# EAGLE design amg8833 (EAGLE 8.0.1)
PROJECT_AUTHOR: tinkerman.cat <xose.perez@gmail.com>; PROJECT_LICENSE: CC-BY-SA 3.0; PROJECT_NAME: AMG88XX BOARD; PROJECT_VERSION: 0.2.200170529
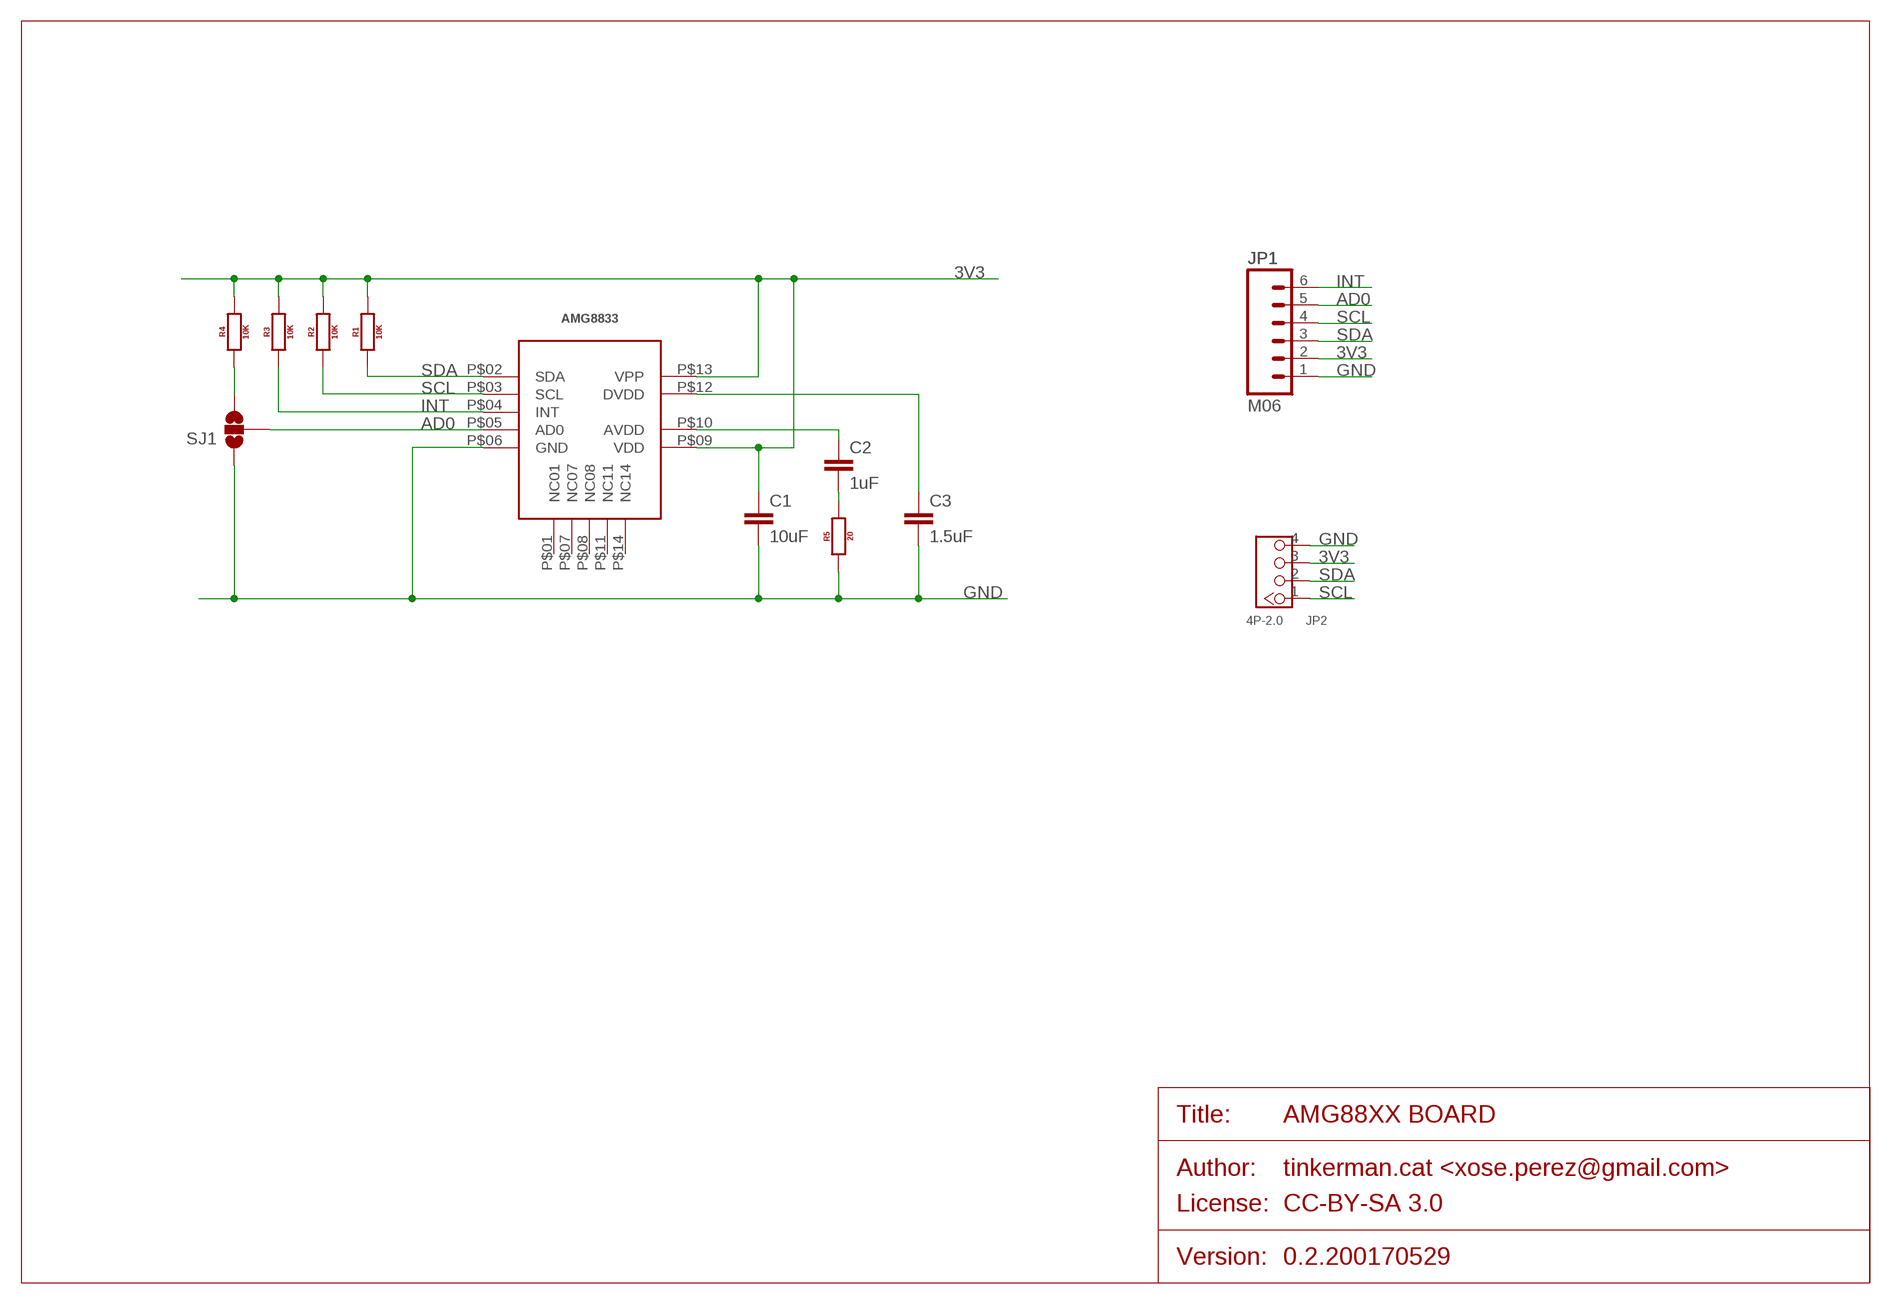
[diagram p0: schematic, sheet 1]

## Parts
AMG8833  AMG88XX  [AMG88XX]
C1  10uF  C-EU0805  [0805]
C2  1uF  C-EU0805  [0805]
C3  1.5uF  C-EU0805  [0805]
JP1  M06  [1X06_NO_SILK]
JP2  4P-2.0  GROVE-CONNECTOR-DIP(4P-2.0)  [HW4-2.0]
R1  10K  RESISTOR0805  [0805]
R2  10K  RESISTOR0805  [0805]
R3  10K  RESISTOR0805  [0805]
R4  10K  RESISTOR0805  [0805]
R5  20  RESISTOR0805  [0805]
SJ1  SOLDERJUMPER_2WAYS  [SJ_3]

## Nets
3V3: AMG8833.P$09(VDD) AMG8833.P$13(VPP) C1.1 JP1.2 JP2.3 R1.2 R2.2 R3.2 R4.2
AD0: AMG8833.P$05(AD0) JP1.5 SJ1.2
GND: AMG8833.P$06(GND) C1.2 C3.2 JP1.1 JP2.4 R5.1 SJ1.1
INT: AMG8833.P$04(INT) JP1.6 R3.1
N$2: R4.1 SJ1.3
N$3: C2.2 R5.2
N$7: AMG8833.P$12(DVDD) C3.1
N$8: AMG8833.P$10(AVDD) C2.1
SCL: AMG8833.P$03(SCL) JP1.4 JP2.1 R2.1
SDA: AMG8833.P$02(SDA) JP1.3 JP2.2 R1.1
Unconnected: AMG8833.P$01(NC01) AMG8833.P$07(NC07) AMG8833.P$08(NC08) AMG8833.P$11(NC11) AMG8833.P$14(NC14)

## Library data of the parts
AMG8833 = xose:AMG88XX
C1-C3 = xose:C-EU: CAPACITOR, European symbol
JP1 = xose:M06
JP2 = Seeed-Connector -2016:GROVE-CONNECTOR-DIP(4P-2.0): 320110033
R1-R5 = xose:RESISTOR: Generic EU resistor symbol
SJ1 = xose:SOLDERJUMPER_2WAY: Solder Jumper 2 way solder jumper

## Board
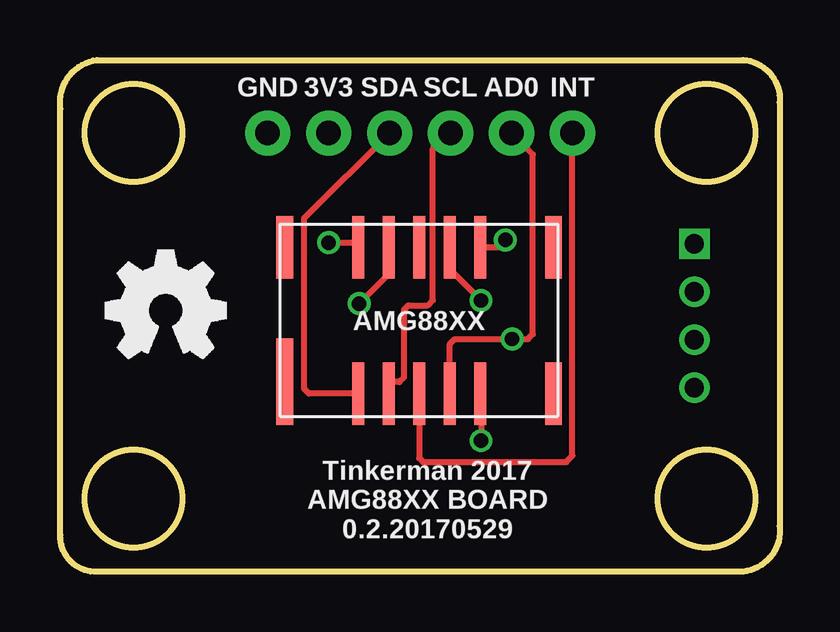
[diagram p1: board, top side]
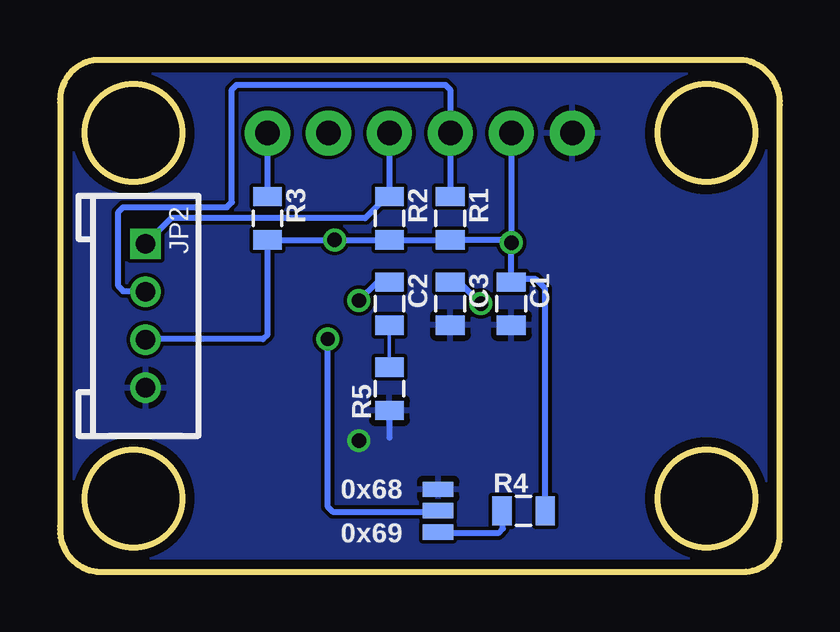
[diagram p2: board, bottom side, seen from below]

Size 30 x 21.34 mm. Coordinates in mm from the lower left corner, seen from the top.
Outline: 0.02,1.52 0.02,19.3 arc-90 1.54,21.34 28.46,21.34 arc-90 29.99,19.56 29.99,1.91 arc-90 28.46,0 1.41,0 arc-90 0.02,1.52
Outline: circle at 3.06,3.05 radius 2.03
Outline: circle at 3.06,18.29 radius 2.03
Outline: circle at 26.94,18.29 radius 2.03
Outline: circle at 26.94,3.05 radius 2.03
Copper layers (1*16): Top 0.0356mm / dielectric 1.5011mm / Bottom 0.0356mm
Design rules "oshpark-2layer": minimum track width 6mil, minimum drill 13mil, track to track 6mil, track to pad 6mil, pad to pad 6mil, via to via 6mil, smd to smd 6mil, copper to edge 15mil, drill to drill 6mil, minimum pad ring 7mil, minimum via ring 7mil, stop-mask expansion 2.5mil, vias tented up to drill 0mil, thermal gap 10mil

### Footprints (pad centres in the part's own frame; a part is rotated, then mirrored left to right if it is on the bottom)
AMG88XX = smd 0.7 x 3.6: P$01 0.2,1.45 | smd 0.5 x 2.6: P$02 3.26,0.95; P$03 4.53,0.95; P$04 5.8,0.95; P$05 7.07,0.95; P$06 8.34,0.95; P$09 8.34,7.05; P$10 7.07,7.05; P$11 5.8,7.05; P$12 4.53,7.05; P$13 3.26,7.05 | smd 0.7 x 2.6: P$07 11.4,0.95; P$08 11.4,7.05; P$14 0.2,7.05
0805 = smd 0.8 x 1.2: 1 -0.9,0; 2 0.9,0
1X06_NO_SILK = drill 1.016 pad 1.88: 1 0,0; 2 2.54,0; 3 5.08,0; 4 7.62,0; 5 10.16,0; 6 12.7,0
HW4-2.0 = drill 0.8 pad 1.27 square: 1 -3,0 | drill 0.8 pad 1.27: 2 -1,0; 3 1,0; 4 3,0
SJ_3 = smd 0.635 x 1.27: 1 -0.889,0; 2 0,0; 3 0.889,0

### Placement (x,y rotation side)
AMG8833  9.16,6.48 0 top
C1  11.19,11.18 270 bottom
C2  16.27,11.18 270 bottom
C3  13.73,11.18 270 bottom
JP1  8.65,18.29 0 top
JP2  26.43,10.67 270 bottom
R1  13.73,14.73 270 bottom
R2  16.27,14.73 270 bottom
R3  21.35,14.73 270 bottom
R4  10.68,2.54 0 bottom
R5  16.27,7.62 90 bottom
SJ1  14.24,2.54 270 bottom

### Tracks (layer width: path | path; a pad name or v marks a point on that pad's centre or on a via)
3V3  (via drill 0.6)
  Top 0.152: 12.3,13.72 AMG8833.P$13
  Top 0.254: v11.19,13.72 12.3,13.72 | 17.54,13.53 AMG8833.P$09 18.25,13.53 v18.56,13.83
  Bottom 0.152: 11.08,12.19 C1.1 | 26.4,9.7 JP2.3 | 11.31,13.83 11.19,13.83 v11.19,13.72 11.31,13.83
  Bottom 0.254: JP1.2 v11.19,13.72 C1.1 | 11.31,13.83 R1.2 R2.2 v18.56,13.83 R3.2 21.35,9.89 21.54,9.7 26.4,9.7 | R4.2 9.78,11.8 10.18,12.19 11.08,12.19
AD0  (via drill 0.6)
  Top 0.254: AMG8833.P$05 16.24,9.5 16.44,9.7 v18.84,9.7 | v18.84,9.7 18.81,9.7 | v18.84,9.7 19.5,9.7 19.7,9.91 19.7,17.4 JP1.5
  Bottom 0.152: 14.28,2.5 SJ1.2
  Bottom 0.254: v18.84,9.7 18.84,2.7 18.64,2.5 14.28,2.5
GND  (via drill 0.6)
  Top 0.254: AMG8833.P$06 17.54,7.43 v17.54,5.46
  Bottom 0.152: 16.39,6.6 R5.1
  Bottom 0.254: R5.1 16.27,5.59
  pour Bottom: -0.49,21.84 32.02,21.84 32.02,-0.51 -0.49,-0.51
INT
  Top 0.254: AMG8833.P$04 14.96,4.74 15.13,4.57 21.1,4.57 21.35,4.83 JP1.6
  Bottom 0.254: R3.1 JP1.6
N$2
  Bottom 0.152: 14.19,1.6 SJ1.3 | 11.54,2.5 R4.1
  Bottom 0.254: 14.19,1.6 11.74,1.6 11.54,1.8 11.54,2.5
N$3
  Bottom 0.152: C2.2 R5.2
N$7  (via drill 0.6)
  Top 0.254: AMG8833.P$12 13.69,12.4 v12.46,11.18
  Bottom 0.254: C3.1 13.36,12.08 v12.46,11.18
N$8  (via drill 0.6)
  Top 0.254: AMG8833.P$10 16.23,12.62 v17.54,11.3
  Bottom 0.254: v17.54,11.3 16.77,12.08 C2.1
SCL
  Top 0.152: 13.73,7.9 AMG8833.P$03
  Top 0.254: JP1.4 15.54,17.66 15.54,11.32 15.32,11.1 14.52,11.1 14.34,10.92 14.34,8.1 14.14,7.9 13.73,7.9
  Bottom 0.152: R2.1 16.39,15.63
  Bottom 0.254: JP1.4 R2.1 | 16.39,15.63 17.29,14.73 25.37,14.73 JP2.1
SDA
  Top 0.254: AMG8833.P$02 10.37,7.43 10.18,7.62 10.18,14.73 JP1.3
  Bottom 0.152: 26.46,11.7 JP2.2
  Bottom 0.254: R1.1 JP1.3 13.74,20.1 13.94,20.3 22.64,20.3 22.84,20.1 22.84,15.4 23.04,15.2 27.36,15.2 27.56,15 27.56,11.9 27.36,11.7 26.46,11.7

### Text on the board
tPlace: Tinkerman 2017 / AMG88XX BOARD / 0.2.20170529
bPlace: 0x68 | 0x69
tNames: GND | 3V3 | SDA | SCL | AD0 | INT